# Altium schematic sheet BOWIE_POWER.SchDoc
size A; SheetNumber: 6; SheetTotal: 7
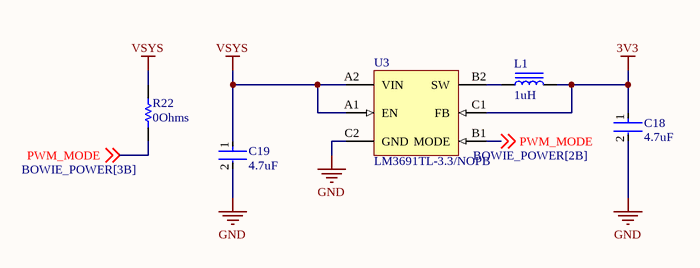
[diagram p0: BOWIE_POWER.SchDoc]

## Parts
C18  4.7uF  [FP-CL828-IPC_C]
C19  4.7uF  [FP-CL828-IPC_C]
L1  1uH  [IND 0603_1608 RF WW]
R22  0Ohms  [RESC1005X40X25ML05T10]
U3  LM3691TL-3.3/NOPB  [YZR0006APAF]

## Nets
3V3: C18.1 L1.2 U3.C1(FB)
GND: C18.2 C19.2 U3.C2(GND)
VSYS: C19.1 R22.1 U3.A1(EN) U3.A2(VIN)
PWM_MODE: R22.2 U3.B1(MODE) ; off-sheet PWM_MODE
NetL1_1: L1.1 U3.B2(SW)

## Library data of the parts
C18 C19 = CMP-13271-001251-1: Cap Ceramic 4.7uF 10V X5R ±10% SMD 0402 +85°C Paper T/R; Height: 0.5mm; Mount: Surface Mount; Case Code (Metric): 1005; Case/Package: 0402; Capacitance: 4.7uF; Packaging: Tape and Reel; Dielectric: X5R; Radiation Hardening: No; Material: Ceramic; Thickness: 0.022inch; Min Operating Temperature: -55°C; Voltage Rating: 10V; Case Code (Imperial): 0402; Width: 0.02inch; Length: 1mm; Max Operating Temperature: 85°C; Lead Free: Lead Free; Tolerance: 10%; Package Quantity: 1; Depth: 0.5mm
L1 = MCHK1608T1R0MKN: SMT Inductor; Manufacturer: Taiyo Yuden; Part Number: MCHK1608T1R0MKN; Value: 1uH
R22 = CMP-2002-03043-1: Part Number: CRCW040210K0FKEDHP; Manufacturer: Vishay Dale
U3 = CMP-0063-01484-2: High Accuracy, Miniature 1A, Step-Down DC-DC Converter for Portable Applications, 6-pin Micro SMD, 250 Reel; Manufacturer: Texas Instruments; PackageTopMarking: XV*I T; PowerWise: N; CompType: MiscPower; High-Reliability: Y; RoHS: Y; PackageDescription: Thin Micro SMD, 6 Bump (Large), 0.5mm Pitch; PinCount: 6; ComponentLink1URL: http://www.ti.com/general/docs/lit/getliterature.tsp?genericPartNumber=LM3691&fileType=pdf; PackageReference: YZR0006APAF; PartNumber: LM3691TL-3.3/NOPB; ComponentLink1Description: Datasheet URL; Code_JEDEC: MO-211-DB